# EAGLE design LIC_rack_ZB-00 (EAGLE 7.2.0)
AUTHOR: M. Petrilak; VERSION: 0.1

## Sheet 1 of 3
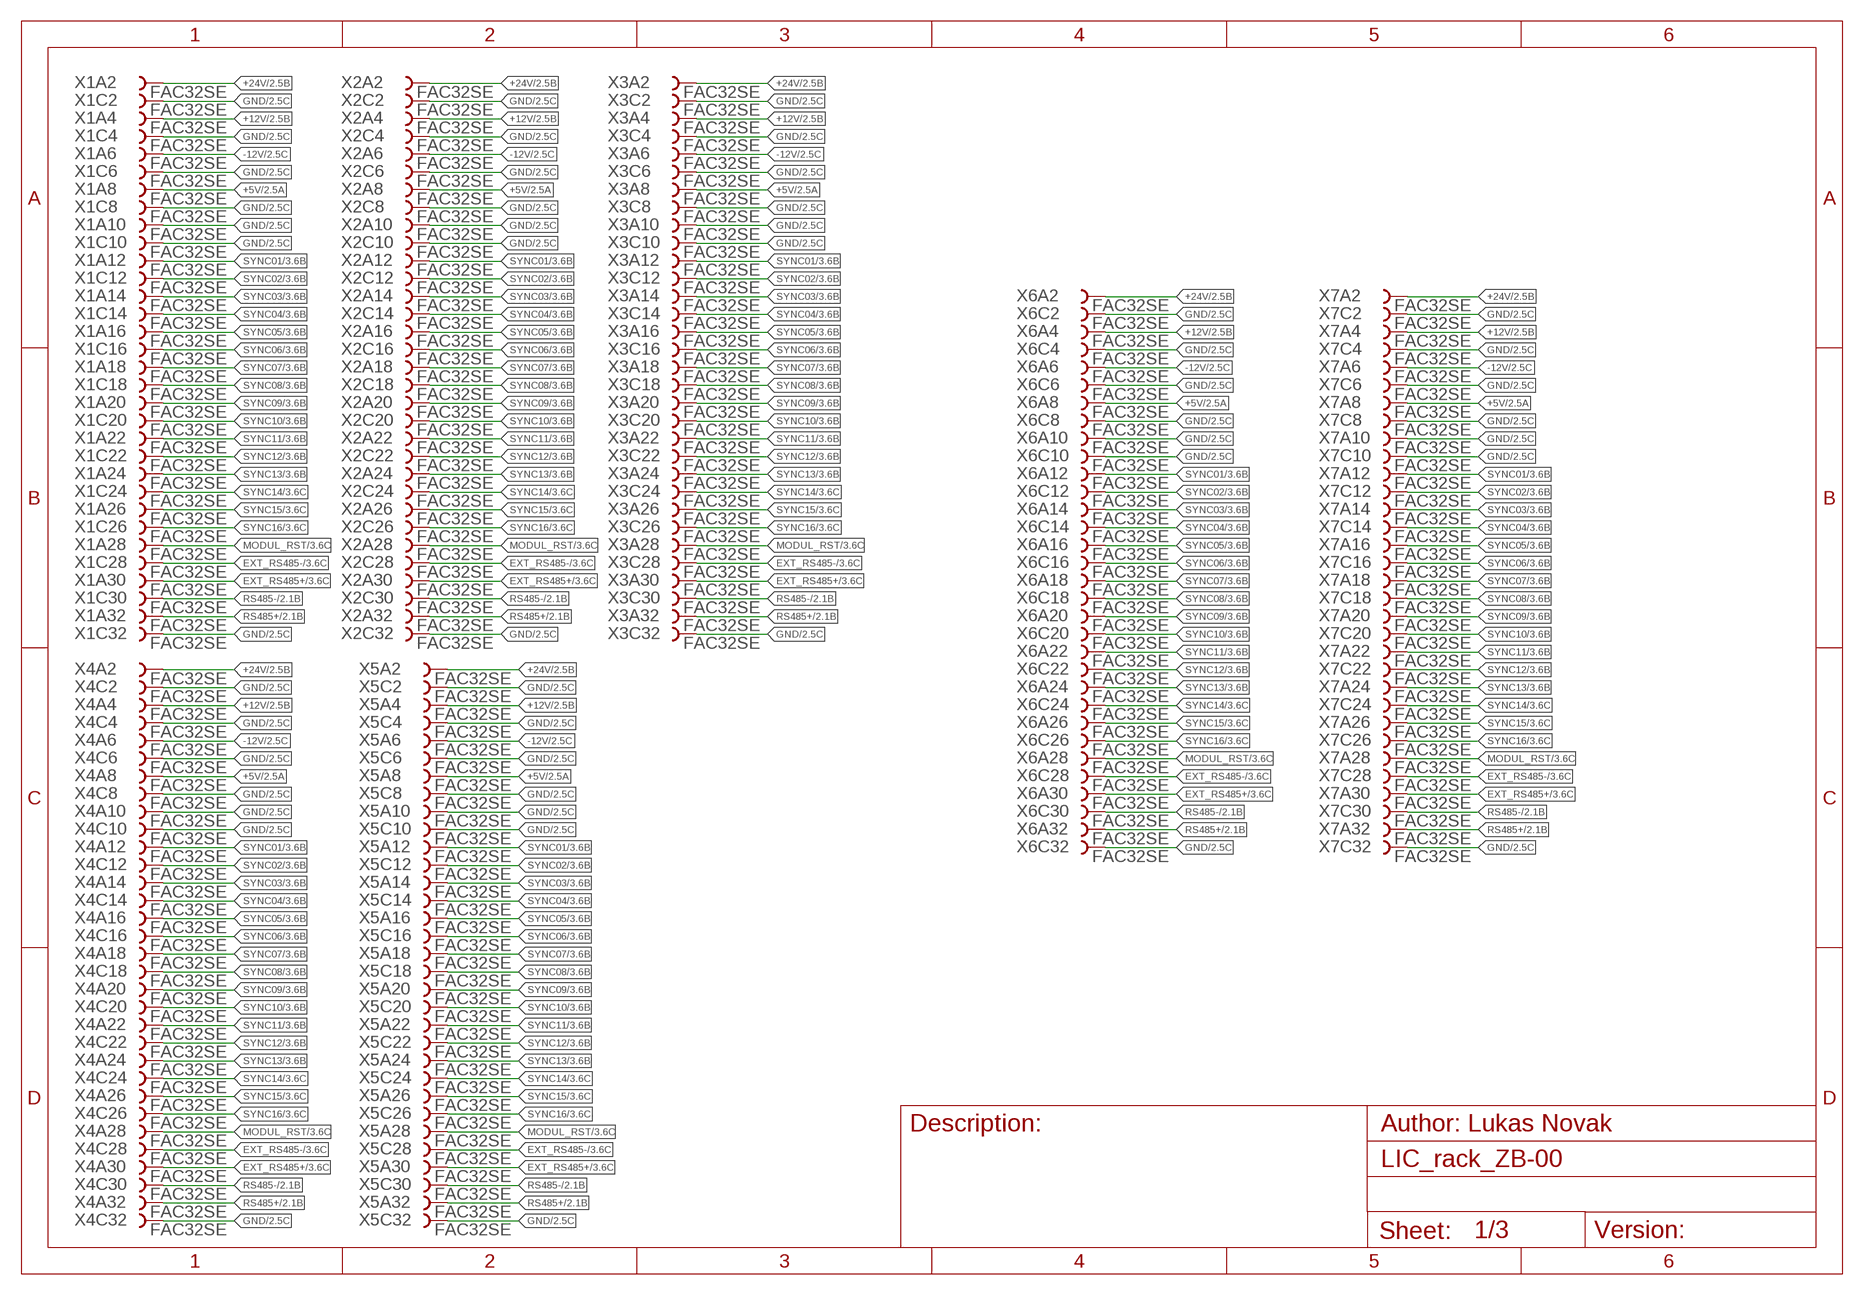
[diagram p0: schematic, sheet 1]

### Parts
X1  FAC32SE  [FAC32S]
X2  FAC32SE  [FAC32S]
X3  FAC32SE  [FAC32S]
X4  FAC32SE  [FAC32S]
X5  FAC32SE  [FAC32S]
X6  FAC32SE  [FAC32S]
X7  FAC32SE  [FAC32S]

### Nets
+5V: X1.A8 X2.A8 X3.A8 X4.A8 X5.A8 X6.A8 X7.A8 ; also sheet 2,3
+12V: X1.A4 X2.A4 X3.A4 X4.A4 X5.A4 X6.A4 X7.A4 ; also sheet 2,3
+24V: X1.A2 X2.A2 X3.A2 X4.A2 X5.A2 X6.A2 X7.A2 ; also sheet 2,3
-12V: X1.A6 X2.A6 X3.A6 X4.A6 X5.A6 X6.A6 X7.A6 ; also sheet 2,3
EXT_RS485+: X1.A30 X2.A30 X3.A30 X4.A30 X5.A30 X6.A30 X7.A30 ; also sheet 3
EXT_RS485-: X1.C28 X2.C28 X3.C28 X4.C28 X5.C28 X6.C28 X7.C28 ; also sheet 3
GND: X1.A10 X1.C2 X1.C4 X1.C6 X1.C8 X1.C10 X1.C32 X2.A10 X2.C2 X2.C4 X2.C6 X2.C8 X2.C10 X2.C32 X3.A10 X3.C2 X3.C4 X3.C6 X3.C8 X3.C10 X3.C32 X4.A10 X4.C2 X4.C4 X4.C6 X4.C8 X4.C10 X4.C32 X5.A10 X5.C2 X5.C4 X5.C6 X5.C8 X5.C10 X5.C32 X6.A10 X6.C2 X6.C4 X6.C6 X6.C8 X6.C10 X6.C32 X7.A10 X7.C2 X7.C4 X7.C6 X7.C8 X7.C10 X7.C32 ; also sheet 2,3
MODUL_RST: X1.A28 X2.A28 X3.A28 X4.A28 X5.A28 X6.A28 X7.A28 ; also sheet 3
RS485+: X1.A32 X2.A32 X3.A32 X4.A32 X5.A32 X6.A32 X7.A32 ; also sheet 2,3
RS485-: X1.C30 X2.C30 X3.C30 X4.C30 X5.C30 X6.C30 X7.C30 ; also sheet 2,3
SYNC01: X1.A12 X2.A12 X3.A12 X4.A12 X5.A12 X6.A12 X7.A12 ; also sheet 3
SYNC02: X1.C12 X2.C12 X3.C12 X4.C12 X5.C12 X6.C12 X7.C12 ; also sheet 3
SYNC03: X1.A14 X2.A14 X3.A14 X4.A14 X5.A14 X6.A14 X7.A14 ; also sheet 3
SYNC04: X1.C14 X2.C14 X3.C14 X4.C14 X5.C14 X6.C14 X7.C14 ; also sheet 3
SYNC05: X1.A16 X2.A16 X3.A16 X4.A16 X5.A16 X6.A16 X7.A16 ; also sheet 3
SYNC06: X1.C16 X2.C16 X3.C16 X4.C16 X5.C16 X6.C16 X7.C16 ; also sheet 3
SYNC07: X1.A18 X2.A18 X3.A18 X4.A18 X5.A18 X6.A18 X7.A18 ; also sheet 3
SYNC08: X1.C18 X2.C18 X3.C18 X4.C18 X5.C18 X6.C18 X7.C18 ; also sheet 3
SYNC09: X1.A20 X2.A20 X3.A20 X4.A20 X5.A20 X6.A20 X7.A20 ; also sheet 3
SYNC10: X1.C20 X2.C20 X3.C20 X4.C20 X5.C20 X6.C20 X7.C20 ; also sheet 3
SYNC11: X1.A22 X2.A22 X3.A22 X4.A22 X5.A22 X6.A22 X7.A22 ; also sheet 3
SYNC12: X1.C22 X2.C22 X3.C22 X4.C22 X5.C22 X6.C22 X7.C22 ; also sheet 3
SYNC13: X1.A24 X2.A24 X3.A24 X4.A24 X5.A24 X6.A24 X7.A24 ; also sheet 3
SYNC14: X1.C24 X2.C24 X3.C24 X4.C24 X5.C24 X6.C24 X7.C24 ; also sheet 3
SYNC15: X1.A26 X2.A26 X3.A26 X4.A26 X5.A26 X6.A26 X7.A26 ; also sheet 3
SYNC16: X1.C26 X2.C26 X3.C26 X4.C26 X5.C26 X6.C26 X7.C26 ; also sheet 3

## Sheet 2 of 3
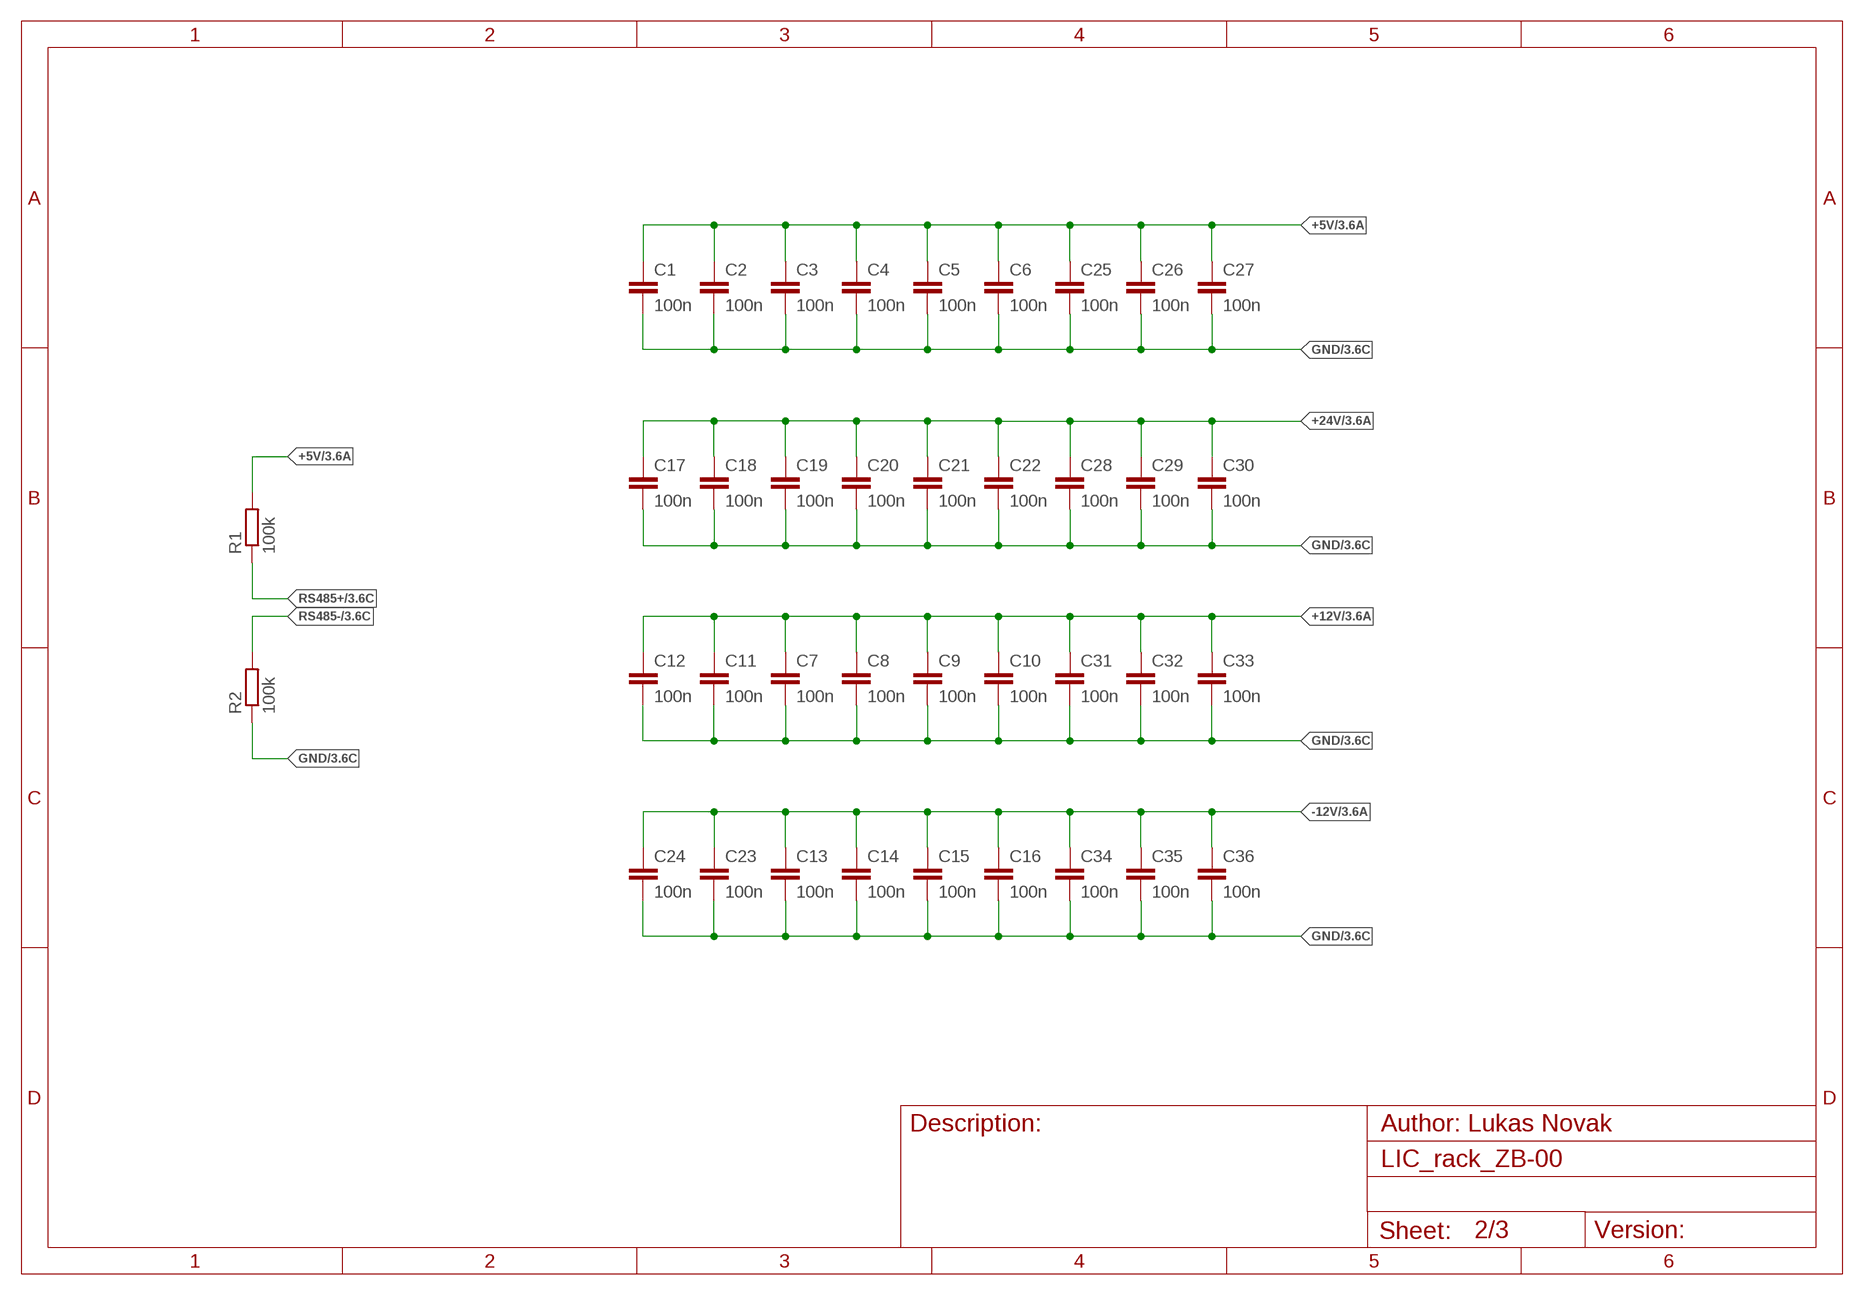
[diagram p1: schematic, sheet 2]

### Parts
C1  100n  C-EUC1206  [C1206]
C2  100n  C-EUC1206  [C1206]
C3  100n  C-EUC1206  [C1206]
C4  100n  C-EUC1206  [C1206]
C5  100n  C-EUC1206  [C1206]
C6  100n  C-EUC1206  [C1206]
C7  100n  C-EUC1206  [C1206]
C8  100n  C-EUC1206  [C1206]
C9  100n  C-EUC1206  [C1206]
C10  100n  C-EUC1206  [C1206]
C11  100n  C-EUC1206  [C1206]
C12  100n  C-EUC1206  [C1206]
C13  100n  C-EUC1206  [C1206]
C14  100n  C-EUC1206  [C1206]
C15  100n  C-EUC1206  [C1206]
C16  100n  C-EUC1206  [C1206]
C17  100n  C-EUC1206  [C1206]
C18  100n  C-EUC1206  [C1206]
C19  100n  C-EUC1206  [C1206]
C20  100n  C-EUC1206  [C1206]
C21  100n  C-EUC1206  [C1206]
C22  100n  C-EUC1206  [C1206]
C23  100n  C-EUC1206  [C1206]
C24  100n  C-EUC1206  [C1206]
C25  100n  C-EUC1206  [C1206]
C26  100n  C-EUC1206  [C1206]
C27  100n  C-EUC1206  [C1206]
C28  100n  C-EUC1206  [C1206]
C29  100n  C-EUC1206  [C1206]
C30  100n  C-EUC1206  [C1206]
C31  100n  C-EUC1206  [C1206]
C32  100n  C-EUC1206  [C1206]
C33  100n  C-EUC1206  [C1206]
C34  100n  C-EUC1206  [C1206]
C35  100n  C-EUC1206  [C1206]
C36  100n  C-EUC1206  [C1206]
R1  100k  R-EU_R1206  [R1206]
R2  100k  R-EU_R1206  [R1206]

### Nets
+5V: C1.1 C2.1 C3.1 C4.1 C5.1 C6.1 C25.1 C26.1 C27.1 R1.2 ; also sheet 1,3
+12V: C7.1 C8.1 C9.1 C10.1 C11.1 C12.1 C31.1 C32.1 C33.1 ; also sheet 1,3
+24V: C17.1 C18.1 C19.1 C20.1 C21.1 C22.1 C28.1 C29.1 C30.1 ; also sheet 1,3
-12V: C13.1 C14.1 C15.1 C16.1 C23.1 C24.1 C34.1 C35.1 C36.1 ; also sheet 1,3
GND: C1.2 C2.2 C3.2 C4.2 C5.2 C6.2 C7.2 C8.2 C9.2 C10.2 C11.2 C12.2 C13.2 C14.2 C15.2 C16.2 C17.2 C18.2 C19.2 C20.2 C21.2 C22.2 C23.2 C24.2 C25.2 C26.2 C27.2 C28.2 C29.2 C30.2 C31.2 C32.2 C33.2 C34.2 C35.2 C36.2 R2.1 ; also sheet 1,3
RS485+: R1.1 ; also sheet 1,3
RS485-: R2.2 ; also sheet 1,3

## Sheet 3 of 3
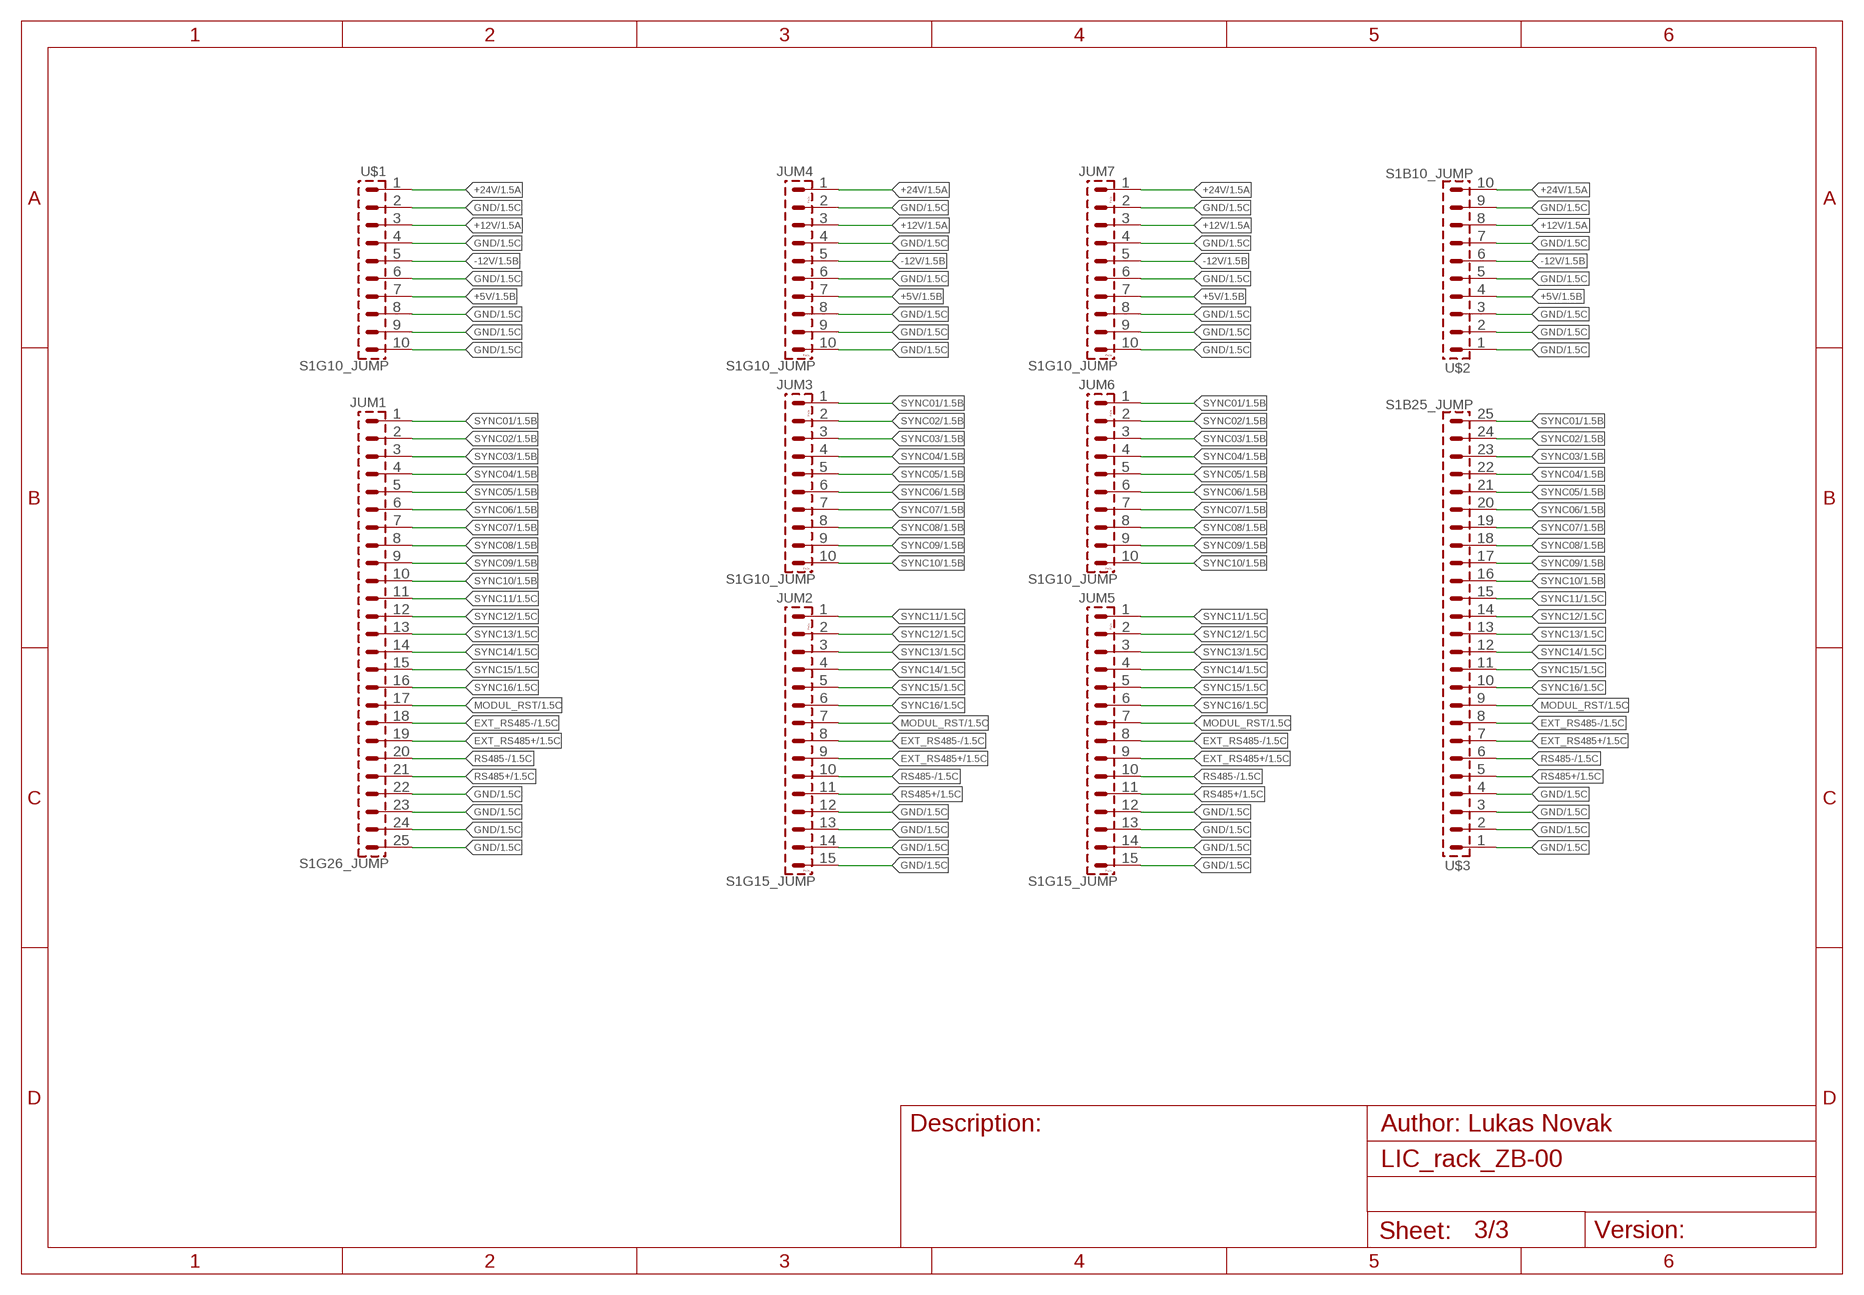
[diagram p2: schematic, sheet 3]

### Parts
JUM1  S1G26_JUMP  [S1G26_JU]
JUM2  S1G15_JUMP  [S1G15_JU]
JUM3  S1G10_JUMP  [S1G10_JU]
JUM4  S1G10_JUMP  [S1G10_JU]
JUM5  S1G15_JUMP  [S1G15_JU]
JUM6  S1G10_JUMP  [S1G10_JU]
JUM7  S1G10_JUMP  [S1G10_JU]
U$1  S1G10_JUMP  [S1G6_JU]
U$2  S1B10_JUMP  [S1B10_JU]
U$3  S1B25_JUMP  [S1B26_JU]

### Nets
+5V: JUM4.7 JUM7.7 U$1.7 U$2.4 ; also sheet 1,2
+12V: JUM4.3 JUM7.3 U$1.3 U$2.8 ; also sheet 1,2
+24V: JUM4.1 JUM7.1 U$1.1 U$2.10 ; also sheet 1,2
-12V: JUM4.5 JUM7.5 U$1.5 U$2.6 ; also sheet 1,2
EXT_RS485+: JUM1.19 JUM2.9 JUM5.9 U$3.7 ; also sheet 1
EXT_RS485-: JUM1.18 JUM2.8 JUM5.8 U$3.8 ; also sheet 1
GND: JUM1.22 JUM1.23 JUM1.24 JUM1.25 JUM2.12 JUM2.13 JUM2.14 JUM2.15 JUM4.2 JUM4.4 JUM4.6 JUM4.8 JUM4.9 JUM4.10 JUM5.12 JUM5.13 JUM5.14 JUM5.15 JUM7.2 JUM7.4 JUM7.6 JUM7.8 JUM7.9 JUM7.10 U$1.2 U$1.4 U$1.6 U$1.8 U$1.9 U$1.10 U$2.1 U$2.2 U$2.3 U$2.5 U$2.7 U$2.9 U$3.1 U$3.2 U$3.3 U$3.4 ; also sheet 1,2
MODUL_RST: JUM1.17 JUM2.7 JUM5.7 U$3.9 ; also sheet 1
RS485+: JUM1.21 JUM2.11 JUM5.11 U$3.5 ; also sheet 1,2
RS485-: JUM1.20 JUM2.10 JUM5.10 U$3.6 ; also sheet 1,2
SYNC01: JUM1.1 JUM3.1 JUM6.1 U$3.25 ; also sheet 1
SYNC02: JUM1.2 JUM3.2 JUM6.2 U$3.24 ; also sheet 1
SYNC03: JUM1.3 JUM3.3 JUM6.3 U$3.23 ; also sheet 1
SYNC04: JUM1.4 JUM3.4 JUM6.4 U$3.22 ; also sheet 1
SYNC05: JUM1.5 JUM3.5 JUM6.5 U$3.21 ; also sheet 1
SYNC06: JUM1.6 JUM3.6 JUM6.6 U$3.20 ; also sheet 1
SYNC07: JUM1.7 JUM3.7 JUM6.7 U$3.19 ; also sheet 1
SYNC08: JUM1.8 JUM3.8 JUM6.8 U$3.18 ; also sheet 1
SYNC09: JUM1.9 JUM3.9 JUM6.9 U$3.17 ; also sheet 1
SYNC10: JUM1.10 JUM3.10 JUM6.10 U$3.16 ; also sheet 1
SYNC11: JUM1.11 JUM2.1 JUM5.1 U$3.15 ; also sheet 1
SYNC12: JUM1.12 JUM2.2 JUM5.2 U$3.14 ; also sheet 1
SYNC13: JUM1.13 JUM2.3 JUM5.3 U$3.13 ; also sheet 1
SYNC14: JUM1.14 JUM2.4 JUM5.4 U$3.12 ; also sheet 1
SYNC15: JUM1.15 JUM2.5 JUM5.5 U$3.11 ; also sheet 1
SYNC16: JUM1.16 JUM2.6 JUM5.6 U$3.10 ; also sheet 1

## Library data of the parts
C1-C36 = rcl:C-EU: CAPACITOR, European symbol
JUM1 = LIC_ALL-00:S1G26_JUMP: Radove konektory - koliky - 20x
JUM2 JUM5 = #PaJa_konektory:S1G15_JUMP: Radove konektory - koliky - 15x
JUM3 JUM4 JUM6 JUM7 = #PaJa_konektory:S1G10_JUMP: Radove konektory - koliky - 10x
R1 R2 = rcl:R-EU_: RESISTOR, European symbol
U$1 = LIC_ALL-00:S1G10_JUMP
U$2 = LIC_ALL-00:S1B10_JUMP
U$3 = LIC_ALL-00:S1B25_JUMP
X1-X7 = con-vg:FAC32SE: CONNECTOR female, 32 pins, single, type D, rows AC, grid 5.08 mm

## Net classes
0 default: clearance 0.2 mm
1 LNPE: clearance 2.5 mm to class 0, clearance 1 mm

## Board
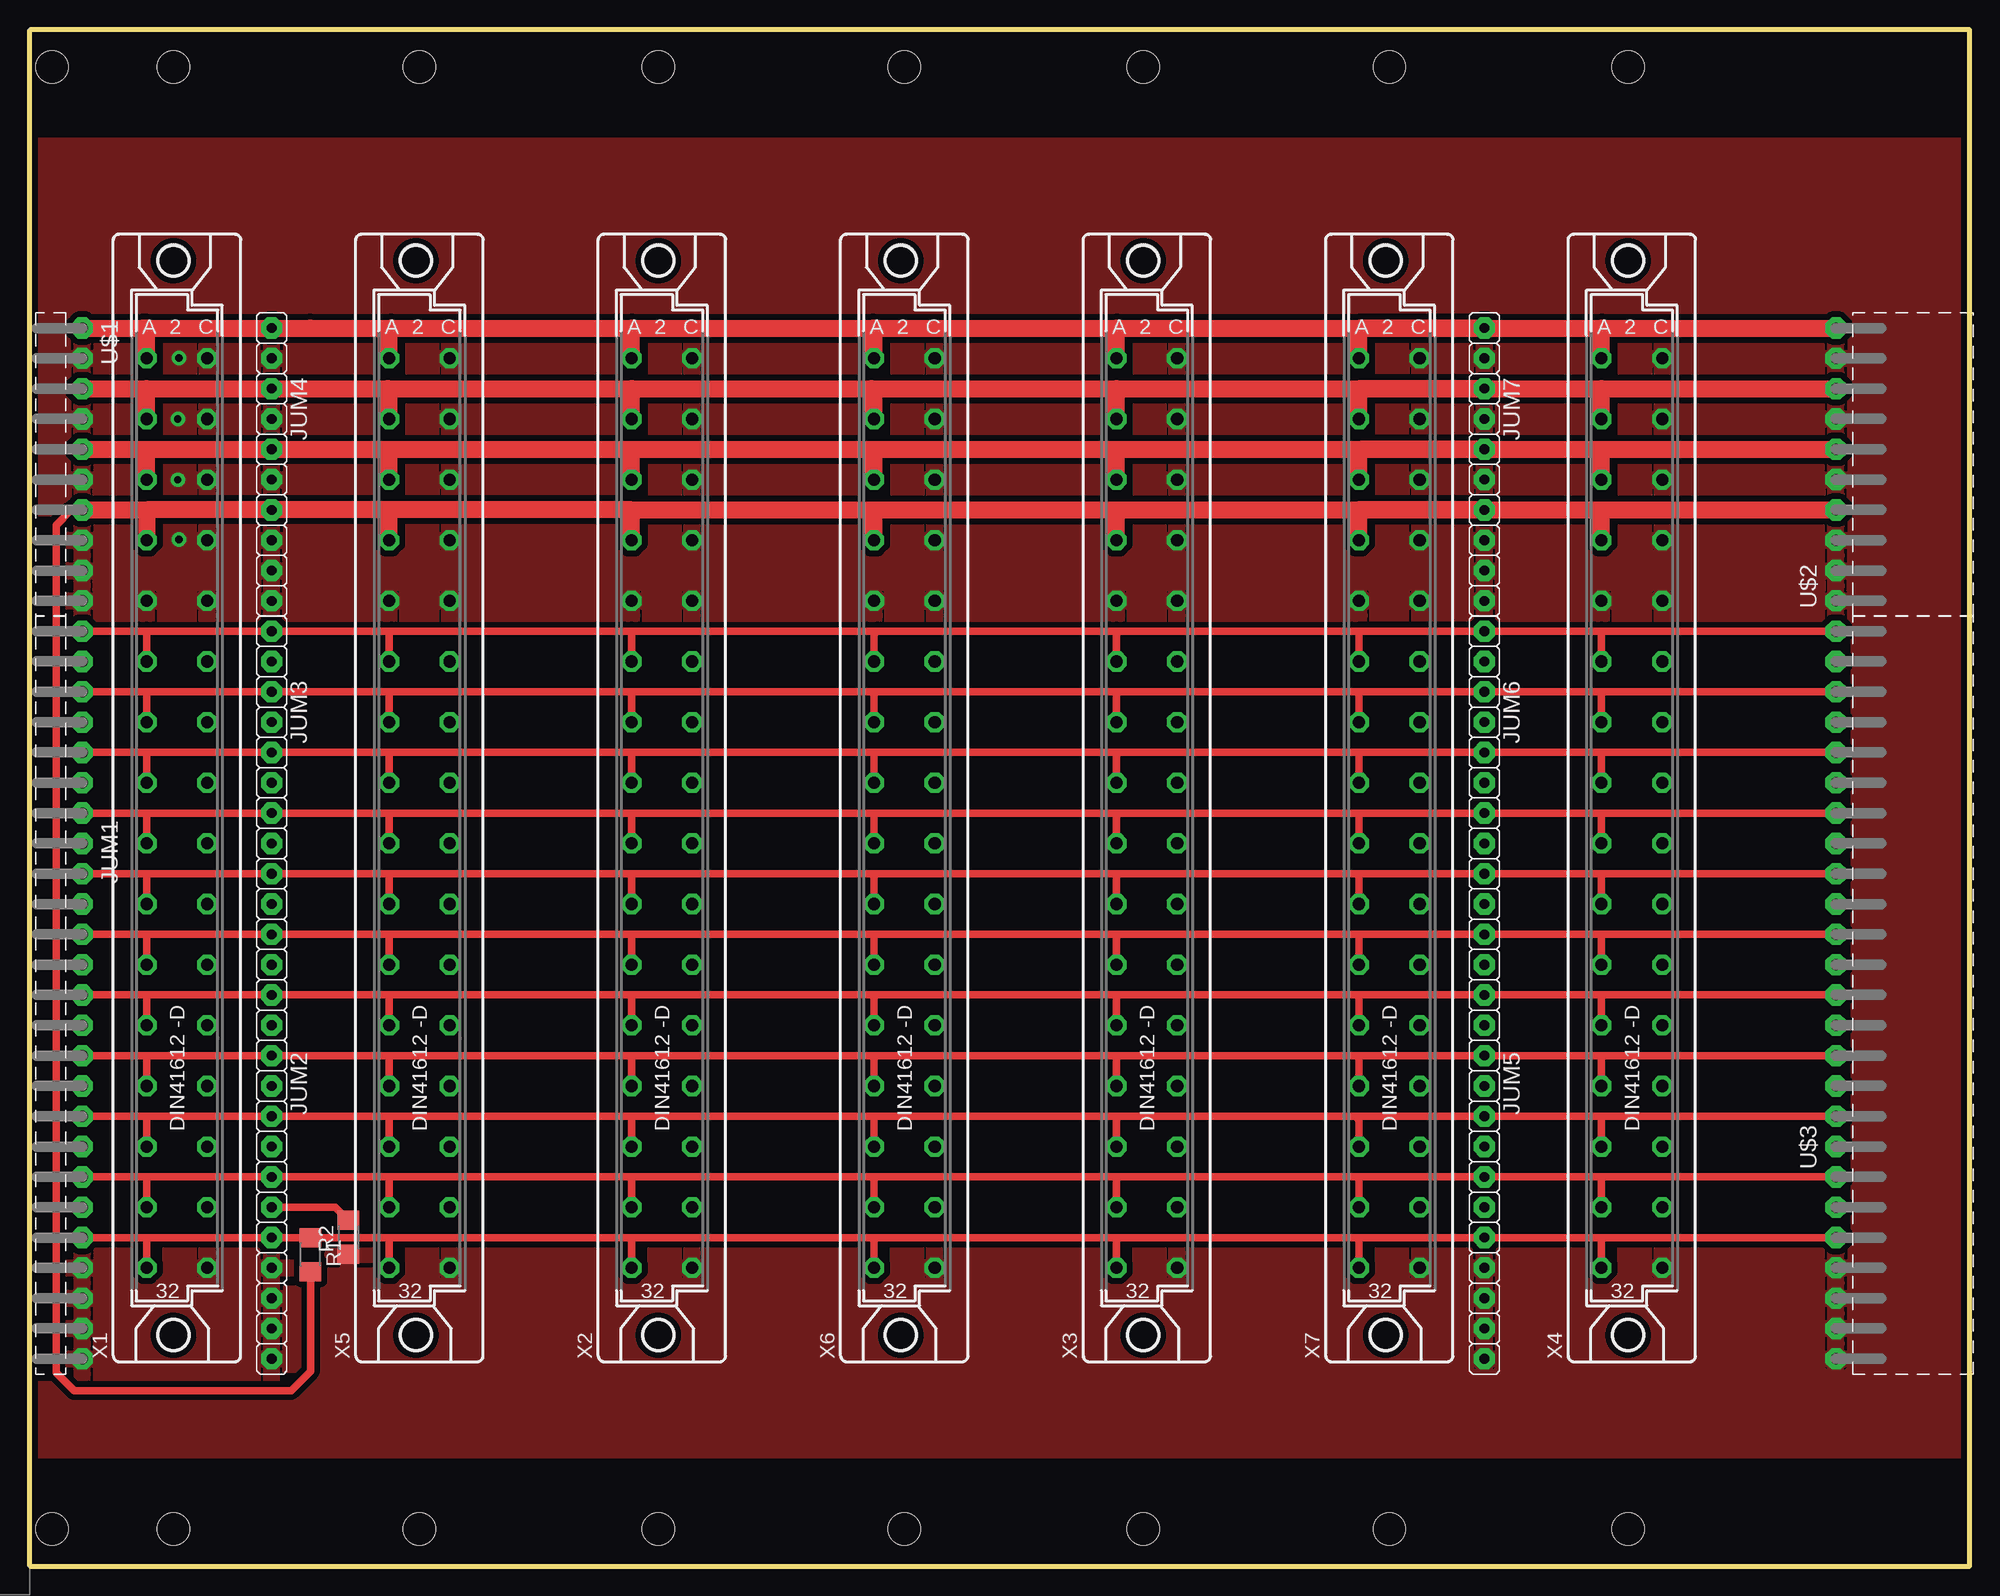
[diagram p3: board, top side]
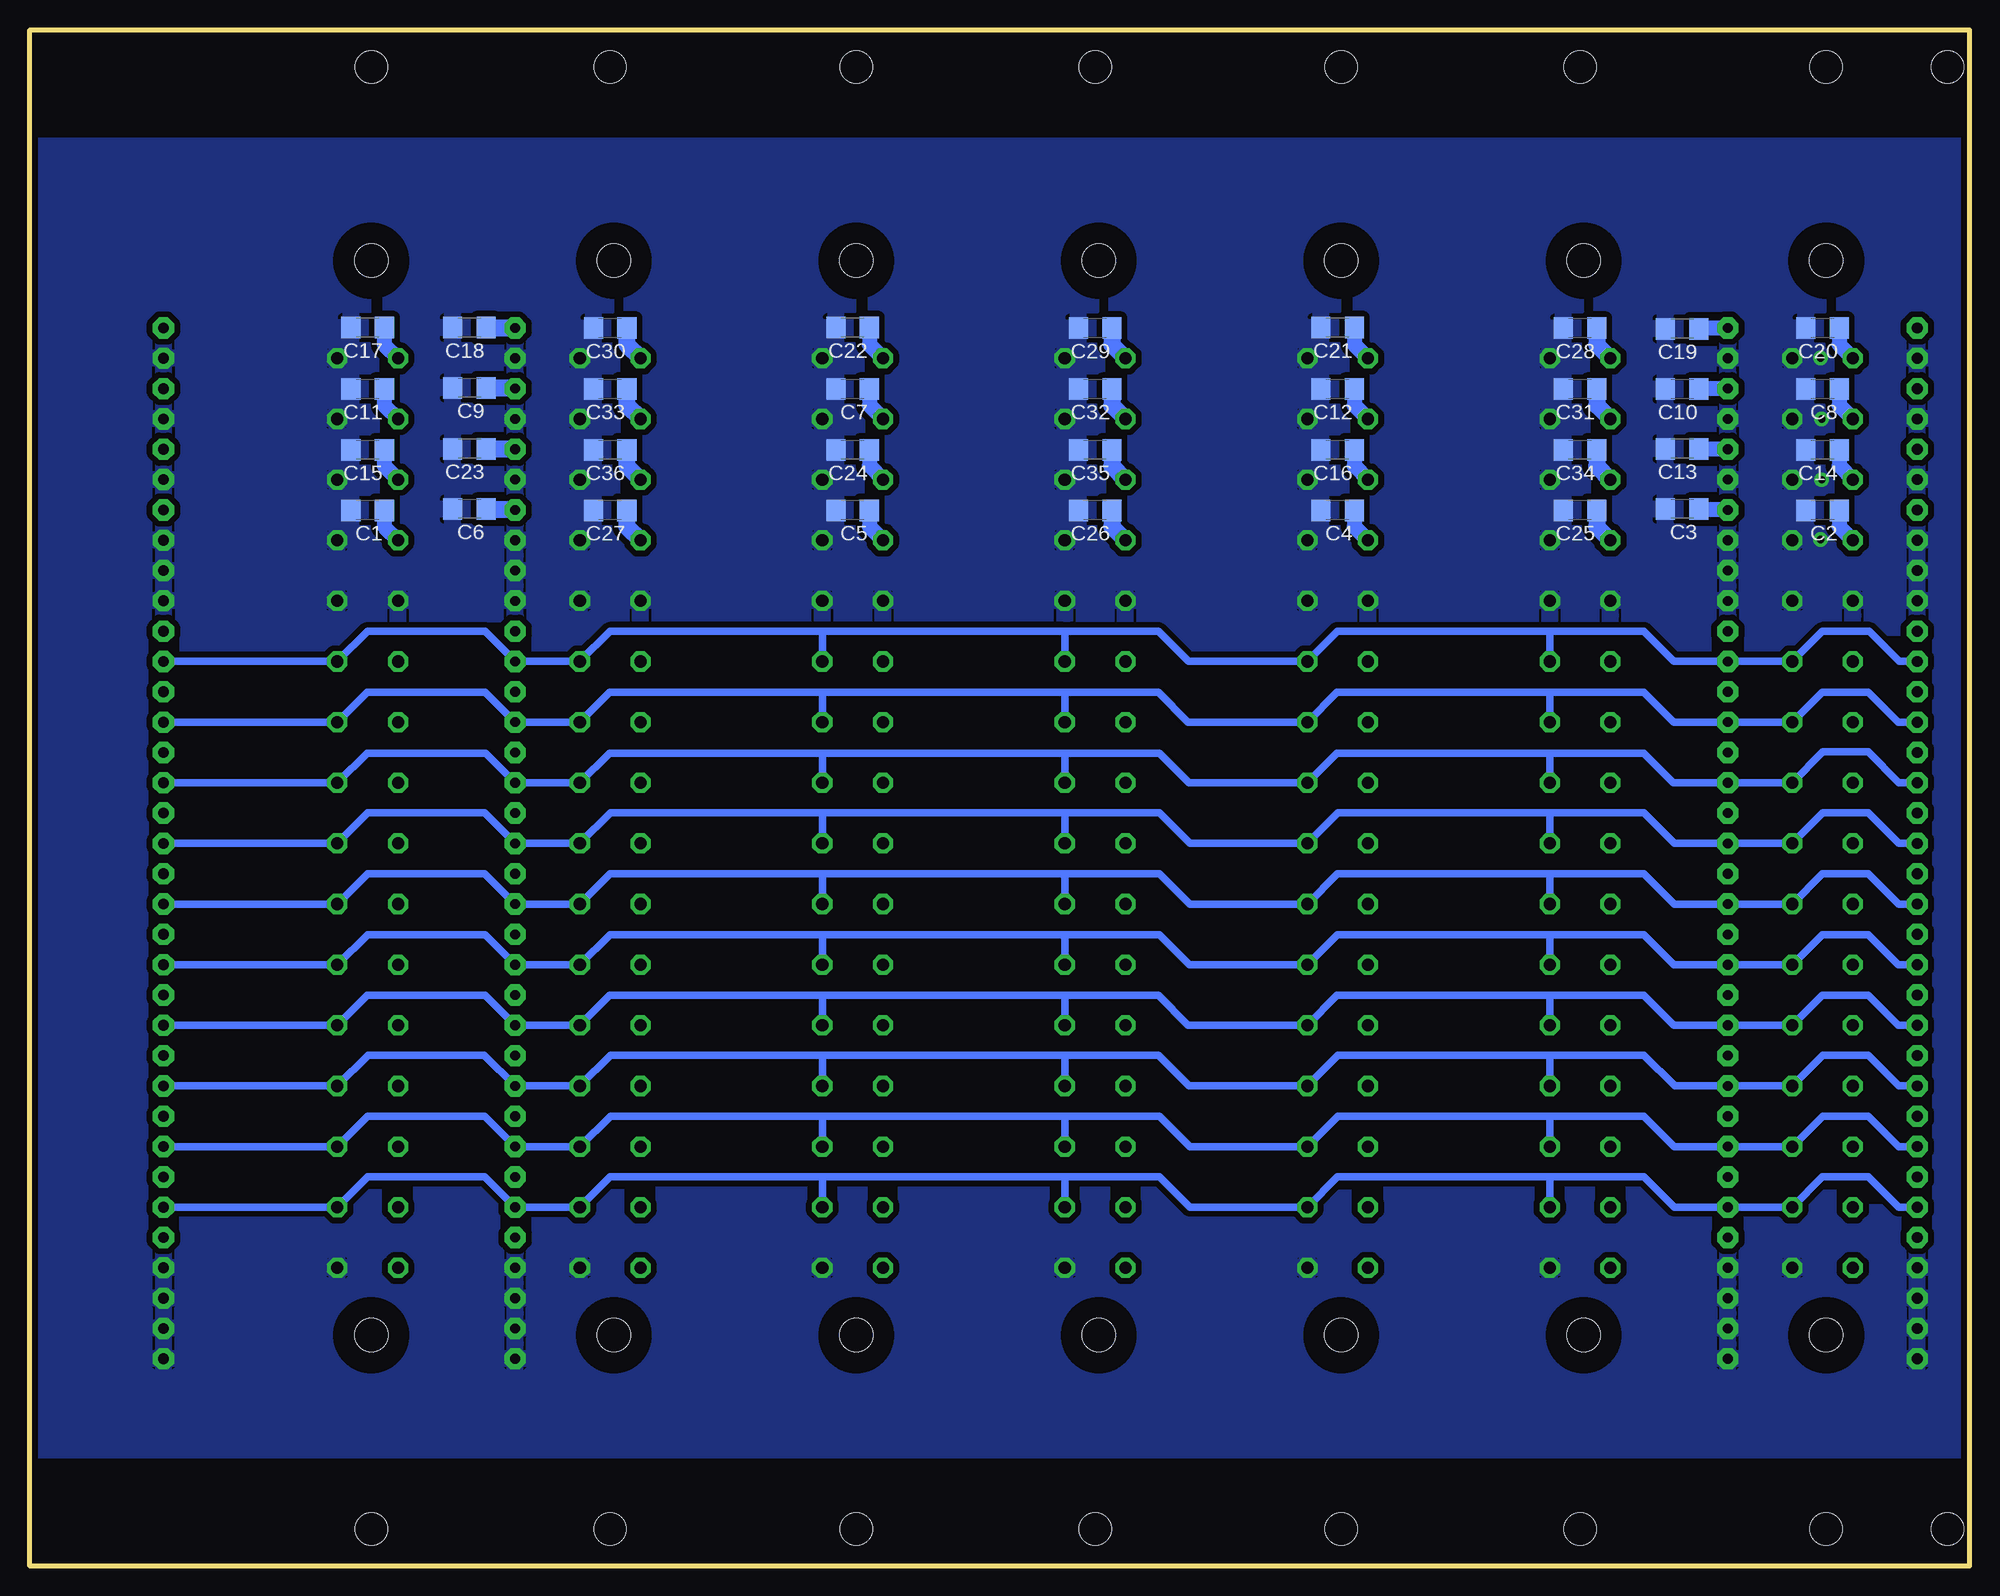
[diagram p4: board, bottom side, seen from below]

Size 162.56 x 128.7 mm. Coordinates in mm from the lower left corner, seen from the top.
Outline: 0,0 162.56,0 162.56,128.7 0,128.7 0,0
Copper layers (1*16): Top 0.04mm / dielectric 1.5mm / Bottom 0.04mm
Design rules "mucha_navrh *": minimum track width 0.2mm, minimum drill 0.6mm, track to track 0.5mm, track to pad 0.5mm, pad to pad 0.3mm, via to via 0.3mm, smd to smd 0mil, copper to edge 0.5mm, drill to drill 0.5mm, minimum pad ring 0.3mm, minimum via ring 0.3mm, stop-mask expansion 0.1mm, vias tented up to drill 0.8mm, thermal gap 0.3mm
Holes 2.7 mm at 1.87,125.6 1.87,3.1 12.03,3.1 52.67,125.6 52.67,3.1 93.31,125.6 133.95,125.6 12.03,125.6 93.31,3.1 133.95,3.1 32.65,125.6 73.29,125.6 113.93,125.6 32.65,3.1 73.29,3.1 113.93,3.1
tRestrict: area -5.6,119.7 to 162.6,128.7; area -5.6,0 to 162.6,9
bRestrict: area -5.6,119.7 to 162.6,128.7; area -5.6,0 to 162.6,9
vRestrict: area -5.6,119.7 to 162.6,128.7; area -5.6,0 to 162.6,9

### Footprints (pad centres in the part's own frame; a part is rotated, then mirrored left to right if it is on the bottom)
C1206 = smd 1.6 x 1.8: 1 -1.4,0; 2 1.4,0
S1G26_JU = drill 0.9 pad 1.778 octagon: 1 -60.96,0; 2 -58.42,0; 3 -55.88,0; 4 -53.34,0; 5 -50.8,0; 6 -48.26,0; 7 -45.72,0; 8 -43.18,0; 9 -40.64,0; 10 -38.1,0; 11 -35.56,0; 12 -33.02,0; 13 -30.48,0; 14 -27.94,0; 15 -25.4,0; 16 -22.86,0; 17 -20.32,0; 18 -17.78,0; 19 -15.24,0; 20 -12.7,0; 21 -10.16,0; 22 -7.62,0; 23 -5.08,0; 24 -2.54,0; 25 0,0
S1G15_JU = drill 0.813 pad 1.778 octagon: 1 -17.78,0; 2 -15.24,0; 3 -12.7,0; 4 -10.16,0; 5 -7.62,0; 6 -5.08,0; 7 -2.54,0; 8 0,0; 9 2.54,0; 10 5.08,0; 11 7.62,0; 12 10.16,0; 13 12.7,0; 14 15.24,0; 15 17.78,0
S1G10_JU = drill 0.813 pad 1.778 octagon: 1 -11.43,0; 2 -8.89,0; 3 -6.35,0; 4 -3.81,0; 5 -1.27,0; 6 1.27,0; 7 3.81,0; 8 6.35,0; 9 8.89,0; 10 11.43,0
R1206 = smd 1.6 x 1.803: 1 -1.422,0; 2 1.422,0
S1G6_JU = drill 0.9 pad 1.778 octagon: 1 -22.86,0; 2 -20.32,0; 3 -17.78,0; 4 -15.24,0; 5 -12.7,0; 6 -10.16,0; 7 -7.62,0; 8 -5.08,0; 9 -2.54,0; 10 0,0
S1B10_JU = drill 0.9 pad 1.778 octagon: 1 0,0; 2 2.54,0; 3 5.08,0; 4 7.62,0; 5 10.16,0; 6 12.7,0; 7 15.24,0; 8 17.78,0; 9 20.32,0; 10 22.86,0
S1B26_JU = drill 0.9 pad 1.778 octagon: 1 0,0; 2 2.54,0; 3 5.08,0; 4 7.62,0; 5 10.16,0; 6 12.7,0; 7 15.24,0; 8 17.78,0; 9 20.32,0; 10 22.86,0; 11 25.4,0; 12 27.94,0; 13 30.48,0; 14 33.02,0; 15 35.56,0; 16 38.1,0; 17 40.64,0; 18 43.18,0; 19 45.72,0; 20 48.26,0; 21 50.8,0; 22 53.34,0; 23 55.88,0; 24 58.42,0; 25 60.96,0
FAC32S = drill 1.016 octagon: A2 -2.54,36.83; A4 -2.54,31.75; A6 -2.54,26.67; A8 -2.54,21.59; A10 -2.54,16.51; A12 -2.54,11.43; A14 -2.54,6.35; A16 -2.54,1.27; A18 -2.54,-3.81; A20 -2.54,-8.89; A22 -2.54,-13.97; A24 -2.54,-19.05; A26 -2.54,-24.13; A28 -2.54,-29.21; A30 -2.54,-34.29; A32 -2.54,-39.37; C2 2.54,36.83; C4 2.54,31.75; C6 2.54,26.67; C8 2.54,21.59; C10 2.54,16.51; C12 2.54,11.43; C14 2.54,6.35; C16 2.54,1.27; C18 2.54,-3.81; C20 2.54,-8.89; C22 2.54,-13.97; C24 2.54,-19.05; C26 2.54,-24.13; C28 2.54,-29.21; C30 2.54,-34.29; C32 2.54,-39.37 | hole 2.794: -0.305,45.009; -0.305,-45.009

### Placement (x,y rotation side)
C1  134.25,88.45 180 bottom
C2  12.33,88.45 180 bottom
C3  24.09,88.55 180 bottom
C4  52.97,88.45 180 bottom
C5  93.61,88.45 180 bottom
C6  125.72,88.55 180 bottom
C7  93.61,98.6 180 bottom
C8  12.33,98.6 180 bottom
C9  125.72,98.7 180 bottom
C10  24.09,98.6 180 bottom
C11  134.25,98.6 180 bottom
C12  52.97,98.6 180 bottom
C13  24.09,93.6 180 bottom
C14  12.33,93.5 180 bottom
C15  134.25,93.5 180 bottom
C16  52.97,93.5 180 bottom
C17  134.25,103.75 180 bottom
C18  125.72,103.75 180 bottom
C19  24.09,103.65 180 bottom
C20  12.33,103.7 180 bottom
C21  52.97,103.75 180 bottom
C22  93.61,103.75 180 bottom
C23  125.72,93.6 180 bottom
C24  93.61,93.5 180 bottom
C25  32.65,88.45 180 bottom
C26  73.29,88.45 180 bottom
C27  113.93,88.45 180 bottom
C28  32.65,103.7 180 bottom
C29  73.29,103.7 180 bottom
C30  113.93,103.7 180 bottom
C31  32.65,98.6 180 bottom
C32  73.29,98.6 180 bottom
C33  113.93,98.6 180 bottom
C34  32.65,93.5 180 bottom
C35  73.29,93.5 180 bottom
C36  113.93,93.5 180 bottom
JUM1  4.4,17.36 270 top
JUM2  20.26,35.14 270 top
JUM3  20.26,66.89 270 top
JUM4  20.26,92.29 270 top
JUM5  121.89,35.14 270 top
JUM6  121.89,66.89 270 top
JUM7  121.89,92.29 270 top
R1  23.53,26.09 270 top
R2  26.71,27.53 90 top
U$1  4.4,80.86 270 top
U$2  151.36,80.86 90 top
U$3  151.36,17.36 90 top
X1  12.33,64.35 0 top
X2  52.97,64.35 0 top
X3  93.61,64.35 0 top
X4  134.25,64.35 0 top
X5  32.65,64.35 0 top
X6  73.29,64.35 0 top
X7  113.93,64.35 0 top

### Tracks (layer width: path | path; a pad name or v marks a point on that pad's centre or on a via)
+5V
  Top 0.61: R1.2 23.53,16.33 21.9,14.7 3.7,14.7 2.2,16.2 2.2,87.2 3.48,88.48 U$1.7
  Top 1.422: 50.43,88.48 71,88.48 | 71,88.48 91.07,88.48 | 91.07,88.48 JUM7.7 | JUM7.7 111.3,88.48 111.39,88.39 X7.A8 | JUM7.7 131.71,88.48 | 131.71,88.48 U$2.4 | X2.A8 50.43,88.48 | X3.A8 91.07,88.48 | X4.A8 131.71,88.48 | 50.43,88.48 30.1,88.48 | 30.1,88.48 JUM4.7 9.79,88.48 | 9.79,88.48 X1.A8 | U$1.7 9.79,88.48 | X6.A8 70.75,88.23 71,88.48 | X5.A8 30.11,88.47 30.1,88.48
  Bottom 1.27: C1.1 132.85,87.08 X4.A8 | C5.1 92.21,87.08 X3.A8 | C4.1 51.57,87.08 X2.A8 | C2.1 10.93,87.08 X1.A8 | JUM4.7 22.62,88.48 C3.1
  Bottom 1.422: C25.1 31.25,87.08 X5.A8 | C26.1 71.89,87.08 X6.A8 | C27.1 112.53,87.08 X7.A8 | C6.1 121.96,88.55 JUM7.7
+12V
  Top 1.422: 9.79,98.64 JUM4.3 30,98.64 | 30,98.64 50.43,98.64 | 50.43,98.64 70.5,98.64 | 70.5,98.64 91.07,98.64 | 91.07,98.64 JUM7.3 | JUM7.3 111.5,98.64 111.39,98.53 X7.A4 | JUM7.3 131.71,98.64 | 131.71,98.64 U$2.8 | X1.A4 9.79,98.64 | X2.A4 50.43,98.64 | X3.A4 91.07,98.64 | X4.A4 131.71,98.64 | U$1.3 9.79,98.64 | X6.A4 70.75,98.39 70.5,98.64 | X5.A4 30.11,98.53 30,98.64
  Bottom 1.27: C11.1 132.85,97.24 X4.A4 | C7.1 92.21,97.24 X3.A4 | C12.1 51.57,97.24 X2.A4 | C8.1 10.93,97.24 X1.A4 | JUM4.3 22.65,98.64 C10.1
  Bottom 1.422: C31.1 31.25,97.24 X5.A4 | C32.1 71.89,97.24 X6.A4 | C33.1 112.53,97.24 X7.A4 | C9.1 121.95,98.7 JUM7.3
+24V
  Top 1.422: 23.5,103.72 JUM4.1 9.79,103.72 9.79,103.4 | 23.5,103.72 30.3,103.72 | 30.3,103.72 50.43,103.72 | 50.43,103.72 70.7,103.72 | 70.7,103.72 91.07,103.72 | 91.07,103.72 JUM7.1 | JUM7.1 111.5,103.72 111.39,103.61 X7.A2 | JUM7.1 131.71,103.72 | 131.71,103.72 U$2.10 | X1.A2 9.79,103.4 | X2.A2 50.43,103.72 | X3.A2 91.07,103.72 | X4.A2 131.71,103.72 | 23.5,103.71 23.5,103.72 | U$1.1 9.47,103.72 9.79,103.4 | X6.A2 70.75,103.67 70.7,103.72 | X5.A2 30.11,103.53 30.3,103.72
  Bottom 1.27: C17.1 132.85,102.32 X4.A2 | C22.1 92.21,102.32 X3.A2 | C21.1 51.57,102.32 X2.A2 | C20.1 10.93,102.32 X1.A2 | JUM4.1 22.62,103.72 C19.1
  Bottom 1.422: C28.1 31.25,102.32 X5.A2 | C29.1 71.89,102.32 X6.A2 | C30.1 112.53,102.32 X7.A2 | C18.1 121.92,103.75 JUM7.1
-12V
  Top 1.422: 50.43,93.56 70.9,93.56 | 70.9,93.56 91.07,93.56 | 91.07,93.56 JUM7.5 | JUM7.5 111.5,93.56 111.39,93.45 X7.A6 | JUM7.5 131.71,93.56 | 131.71,93.56 U$2.6 | X1.A6 9.79,93.2 | 9.79,93.2 9.79,93.56 JUM4.5 30.2,93.56 | X2.A6 50.43,93.56 | X3.A6 91.07,93.56 | X4.A6 131.71,93.56 | 30.2,93.56 50.43,93.56 | U$1.5 9.43,93.56 9.79,93.2 | X6.A6 70.75,93.41 70.9,93.56 | X5.A6 30.11,93.47 30.2,93.56
  Bottom 1.27: C15.1 132.85,92.16 X4.A6 | C24.1 92.21,92.16 X3.A6 | C16.1 51.57,92.16 X2.A6 | C14.1 10.93,92.16 X1.A6 | JUM4.5 22.65,93.56 C13.1
  Bottom 1.422: C34.1 31.25,92.16 X5.A6 | C35.1 71.89,92.16 X6.A6 | C36.1 112.53,92.16 X7.A6 | C23.1 121.93,93.6 JUM7.5
EXT_RS485+
  Top 0.61: JUM1.19 9.7,32.6 | 9.7,32.6 JUM2.9 29.9,32.6 | 29.9,32.6 50.4,32.6 | 50.4,32.6 70.7,32.6 | 70.7,32.6 91.07,32.6 | 91.07,32.6 JUM5.9 | JUM5.9 111.5,32.6 111.39,32.49 X7.A30 | JUM5.9 131.71,32.6 | 131.71,32.6 U$3.7 | X1.A30 9.79,32.51 9.7,32.6 | X2.A30 50.43,32.57 50.4,32.6 | X3.A30 91.07,32.6 | X4.A30 131.71,32.6 | X5.A30 30.11,32.39 29.9,32.6 | X6.A30 70.75,32.55 70.7,32.6
EXT_RS485-
  Bottom 0.61: JUM1.18 5.94,35.14 8.5,37.7 12.31,37.7 X1.C28 JUM2.8 24.74,35.14 27.3,37.7 35,37.7 | U$3.8 X4.C28 134.23,37.7 124.45,37.7 JUM5.8 X7.C28 113.91,37.7 96.15,37.7 | 35,37.7 52.95,37.7 X2.C28 65.34,35.14 67.9,37.7 75.7,37.7 | X6.C28 75.83,37.57 75.7,37.7 | X5.C28 35.19,37.51 35,37.7 | 75.7,37.7 96.15,37.7 | X3.C28 96.15,37.7
GND  (via drill 0.6)
  other vias: 12.4,91 12.5,86 12.4,96.1 12.5,101.2
  pour Top: 0,128.7 0,0 162.56,0 162.56,128.7
  pour Bottom: 0,0 162.56,0 162.56,128.8 0,128.8
MODUL_RST
  Top 0.61: JUM1.17 9.8,37.68 | 9.8,37.68 JUM2.7 29.9,37.68 | 29.9,37.68 50.4,37.68 | 50.4,37.68 70.7,37.68 | 70.7,37.68 91.07,37.68 | 91.07,37.68 JUM5.7 | JUM5.7 111.1,37.68 111.39,37.39 X7.A28 | JUM5.7 131.71,37.68 | 131.71,37.68 U$3.9 | X1.A28 9.79,37.67 9.8,37.68 | X2.A28 50.43,37.65 50.4,37.68 | X3.A28 91.07,37.68 | X4.A28 131.71,37.68 | X5.A28 30.11,37.47 29.9,37.68 | X6.A28 70.75,37.63 70.7,37.68
RS485+
  Top 0.61: JUM1.21 9.8,27.52 | 9.8,27.52 JUM2.11 23.4,27.52 | 23.4,27.52 30,27.52 | 30,27.52 50.4,27.52 | 50.4,27.52 70.7,27.52 | 70.7,27.52 91.07,27.52 | 91.07,27.52 JUM5.11 | JUM5.11 111.6,27.52 111.39,27.31 X7.A32 | JUM5.11 131.71,27.52 | 131.71,27.52 U$3.5 | X1.A32 9.79,27.51 9.8,27.52 | X2.A32 50.43,27.49 50.4,27.52 | X3.A32 91.07,27.52 | X4.A32 131.71,27.52 | R1.1 23.41,27.51 23.4,27.52 | X5.A32 30.11,27.41 30,27.52 | X6.A32 70.75,27.47 70.7,27.52
RS485-
  Top 0.61: JUM2.10 25.6,30.06 R2.2
  Bottom 0.61: JUM1.20 5.96,30.06 8.5,32.6 12.33,32.6 X1.C30 JUM2.10 24.76,30.06 27.3,32.6 35.4,32.6 | U$3.6 X4.C30 134.25,32.6 124.43,32.6 JUM5.10 X7.C30 113.93,32.6 96.2,32.6 96.15,32.6 | 35.4,32.6 52.97,32.6 X2.C30 65.36,30.06 67.9,32.6 75.8,32.6 | X5.C30 35.19,32.39 35.4,32.6 | X6.C30 75.83,32.57 75.8,32.6 | 96.15,32.6 75.8,32.6 | X3.C30 96.15,32.6
SYNC01
  Top 0.61: JUM1.1 9.8,78.32 | 9.8,78.32 JUM3.1 30.3,78.32 | 30.3,78.32 50.43,78.32 | 50.43,78.32 71,78.32 | 71,78.32 91.07,78.32 | 91.07,78.32 JUM6.1 | JUM6.1 111.4,78.32 111.39,78.31 X7.A12 | JUM6.1 131.71,78.32 | 131.71,78.32 U$3.25 | X1.A12 9.79,78.31 9.8,78.32 | X2.A12 50.43,78.32 | X3.A12 91.07,78.32 | X4.A12 131.71,78.32 | X5.A12 30.11,78.13 30.3,78.32 | X6.A12 70.75,78.07 71,78.32
SYNC02
  Bottom 0.61: 5.78,75.78 JUM1.2 5.88,75.78 8.4,78.3 12.35,78.3 X1.C12 JUM3.2 24.78,75.78 27.3,78.3 35.4,78.3 | U$3.24 X4.C12 134.27,78.3 124.41,78.3 JUM6.2 X7.C12 113.95,78.3 96.15,78.3 | 35.4,78.3 52.99,78.3 X2.C12 65.48,75.78 68,78.3 76,78.3 | X6.C12 75.83,78.13 76,78.3 | X5.C12 35.19,78.09 35.4,78.3 | 76,78.3 96.15,78.3 | X3.C12 96.15,78.3
SYNC03
  Top 0.61: JUM1.3 9.8,73.24 | 9.8,73.24 JUM3.3 30.2,73.24 | 30.2,73.24 50.43,73.24 | 50.43,73.24 70.7,73.24 | 70.7,73.24 91.07,73.24 | 91.07,73.24 JUM6.3 | JUM6.3 111.6,73.24 111.39,73.03 X7.A14 | JUM6.3 131.71,73.24 | 131.71,73.24 U$3.23 | X1.A14 9.79,73.23 9.8,73.24 | X2.A14 50.43,73.24 | X3.A14 91.07,73.24 | X4.A14 131.71,73.24 | X5.A14 30.11,73.15 30.2,73.24 | X6.A14 70.75,73.19 70.7,73.24
SYNC04
  Bottom 0.61: JUM1.4 6,70.7 8.5,73.2 12.37,73.2 X1.C14 JUM3.4 24.8,70.7 27.3,73.2 35.3,73.2 | U$3.22 X4.C14 134.29,73.2 124.39,73.2 JUM6.4 X7.C14 113.97,73.2 96.15,73.2 | 35.3,73.2 53.01,73.2 X2.C14 65.5,70.7 68,73.2 75.9,73.2 | X6.C14 75.83,73.13 75.9,73.2 | X5.C14 35.19,73.09 35.3,73.2 | 75.9,73.2 96.15,73.2 | X3.C14 96.15,73.2
SYNC05
  Top 0.61: JUM1.5 9.7,68.16 | 9.7,68.16 JUM3.5 29.9,68.16 | 29.9,68.16 50.43,68.16 | 50.43,68.16 70.7,68.16 | 70.7,68.16 91.07,68.16 | 91.07,68.16 JUM6.5 | JUM6.5 111.5,68.16 111.39,68.05 X7.A16 | JUM6.5 131.71,68.16 | 131.71,68.16 U$3.21 | X1.A16 9.79,68.07 9.7,68.16 | X2.A16 50.43,68.16 | X3.A16 91.07,68.16 | X4.A16 131.71,68.16 | X5.A16 30.11,67.95 29.9,68.16 | X6.A16 70.75,68.11 70.7,68.16
SYNC06
  Bottom 0.61: JUM1.6 5.92,65.62 8.5,68.2 12.29,68.2 X1.C16 JUM3.6 24.82,65.62 27.3,68.1 35.3,68.1 | U$3.20 X4.C16 134.31,68.1 124.37,68.1 JUM6.6 X7.C16 113.99,68.1 96.15,68.1 | 35.3,68.1 53.03,68.1 X2.C16 65.42,65.62 67.9,68.1 75.8,68.1 | X6.C16 75.83,68.07 75.8,68.1 | X5.C16 35.19,67.99 35.3,68.1 | 75.8,68.1 96.15,68.1 | X3.C16 96.15,68.1
SYNC07
  Top 0.61: JUM1.7 9.8,63.08 | 9.8,63.08 JUM3.7 30.1,63.08 | 30.1,63.08 50.43,63.08 | 50.43,63.08 70.6,63.08 | 70.6,63.08 91.07,63.08 | 91.07,63.08 JUM6.7 | JUM6.7 111.5,63.08 111.39,62.97 X7.A18 | JUM6.7 131.71,63.08 | 131.71,63.08 U$3.19 | X1.A18 9.79,63.07 9.8,63.08 | X2.A18 50.43,63.08 | X3.A18 91.07,63.08 | X4.A18 131.71,63.08 | X5.A18 30.11,63.07 30.1,63.08 | X6.A18 70.75,62.93 70.6,63.08
SYNC08
  Bottom 0.61: JUM1.8 5.94,60.54 8.5,63.1 12.31,63.1 X1.C18 JUM3.8 24.74,60.54 27.3,63.1 35.1,63.1 | U$3.18 X4.C18 134.23,63.1 124.45,63.1 JUM6.8 X7.C18 113.91,63.1 96.15,63.1 | 35.1,63.1 52.95,63.1 X2.C18 65.34,60.54 67.9,63.1 75.7,63.1 | X6.C18 75.83,62.97 75.7,63.1 | X5.C18 35.19,63.01 35.1,63.1 | 75.7,63.1 96.15,63.1 | X3.C18 96.15,63.1
SYNC09
  Top 0.61: JUM1.9 9.8,58 | 9.8,58 JUM3.9 29.9,58 | 29.9,58 50.43,58 | 50.43,58 70.6,58 | 70.6,58 91.07,58 | 91.07,58 JUM6.9 | JUM6.9 111.5,58 111.39,57.89 X7.A20 | JUM6.9 131.71,58 | 131.71,58 U$3.17 | X1.A20 9.79,57.99 9.8,58 | X2.A20 50.43,58 | X3.A20 91.07,58 | X4.A20 131.71,58 | X5.A20 30.11,57.79 29.9,58 | X6.A20 70.75,57.85 70.6,58
SYNC10
  Bottom 0.61: JUM1.10 5.96,55.46 8.5,58 12.33,58 X1.C20 JUM3.10 24.76,55.46 27.3,58 35.1,58 | U$3.16 X4.C20 134.25,58 124.43,58 JUM6.10 X7.C20 113.93,58 96.15,58 | 35.1,58 52.97,58 X2.C20 65.36,55.46 67.9,58 76.1,58 | X6.C20 75.83,57.73 76.1,58 | X5.C20 35.19,57.91 35.1,58 | 76.1,58 96.15,58 | X3.C20 96.15,58
SYNC11
  Top 0.61: JUM1.11 9.8,52.92 | 9.8,52.92 JUM2.1 30.3,52.92 | 30.3,52.92 50.4,52.92 | 50.4,52.92 70.7,52.92 | 70.7,52.92 91.07,52.92 | 91.07,52.92 JUM5.1 | JUM5.1 111.5,52.92 111.39,52.81 X7.A22 | JUM5.1 131.71,52.92 | 131.71,52.92 U$3.15 | X1.A22 9.79,52.91 9.8,52.92 | X2.A22 50.43,52.89 50.4,52.92 | X3.A22 91.07,52.92 | X4.A22 131.71,52.92 | X5.A22 30.11,52.73 30.3,52.92 | X6.A22 70.75,52.87 70.7,52.92
SYNC12
  Bottom 0.61: JUM1.12 5.98,50.38 8.5,52.9 12.35,52.9 X1.C22 JUM2.2 24.78,50.38 27.3,52.9 35.4,52.9 | U$3.14 X4.C22 134.27,52.9 124.41,52.9 JUM5.2 X7.C22 113.95,52.9 96.15,52.9 | 35.4,52.9 52.99,52.9 X2.C22 65.38,50.38 67.9,52.9 76.1,52.9 | X6.C22 75.83,52.63 76.1,52.9 | X5.C22 35.19,52.69 35.4,52.9 | 76.1,52.9 96.15,52.9 | X3.C22 96.15,52.9
SYNC13
  Top 0.406: 30.11,47.75 20.35,47.75 JUM2.3
  Top 0.61: JUM1.13 9.8,47.84 | 9.8,47.84 JUM2.3 30.2,47.84 | 30.2,47.84 50.4,47.84 | 50.4,47.84 70.6,47.84 | 70.6,47.84 91.07,47.84 | 91.07,47.84 JUM5.3 | JUM5.3 111.6,47.84 111.39,47.63 X7.A24 | JUM5.3 131.71,47.84 | 131.71,47.84 U$3.13 | X1.A24 9.79,47.83 9.8,47.84 | X2.A24 50.43,47.81 50.4,47.84 | X3.A24 91.07,47.84 | X4.A24 131.71,47.84 | X5.A24 30.11,47.75 30.2,47.84 | X6.A24 70.75,47.69 70.6,47.84
SYNC14
  Bottom 0.61: JUM1.14 6,45.3 8.5,47.8 12.37,47.8 X1.C24 JUM2.4 24.8,45.3 27.3,47.8 35.1,47.8 | U$3.12 X4.C24 134.29,47.8 124.39,47.8 JUM5.4 X7.C24 113.97,47.8 96.15,47.8 | 35.1,47.8 53.01,47.8 X2.C24 65.5,45.3 68,47.8 76,47.8 | X6.C24 75.83,47.63 76,47.8 | X5.C24 35.19,47.71 35.1,47.8 | 76,47.8 96.15,47.8 | X3.C24 96.15,47.8
SYNC15
  Top 0.61: JUM1.15 9.8,42.76 | 9.8,42.76 JUM2.5 30.2,42.76 | 30.2,42.76 50.4,42.76 | 50.4,42.76 70.7,42.76 | 70.7,42.76 91.07,42.76 | 91.07,42.76 JUM5.5 | JUM5.5 111.5,42.76 111.39,42.65 X7.A26 | JUM5.5 131.71,42.76 | 131.71,42.76 U$3.11 | X1.A26 9.79,42.75 9.8,42.76 | X2.A26 50.43,42.73 50.4,42.76 | X3.A26 91.07,42.76 | X4.A26 131.71,42.76 | X5.A26 30.11,42.67 30.2,42.76 | X6.A26 70.75,42.71 70.7,42.76
SYNC16
  Bottom 0.61: JUM1.16 5.92,40.22 8.5,42.8 12.29,42.8 X1.C26 JUM2.6 24.72,40.22 27.3,42.8 35,42.8 | U$3.10 X4.C26 134.21,42.8 124.47,42.8 JUM5.6 X7.C26 113.89,42.8 96.15,42.8 | 35,42.8 52.93,42.8 X2.C26 65.42,40.22 68,42.8 75.7,42.8 | X6.C26 75.83,42.67 75.7,42.8 | X5.C26 35.19,42.61 35,42.8 | 75.7,42.8 96.15,42.8 | X3.C26 96.15,42.8

### Text on the board
tTest: 8HU | 2HU | 4HU | 8HU | 2HU | 8HU | 8HU | 8HU | 8HU | 2HU | 4HU | 4HU